# Altium schematic sheet 03 MCU.SchDoc: MCU
size 420 x 297 mm; SheetNumber: 3; SheetTotal: 6
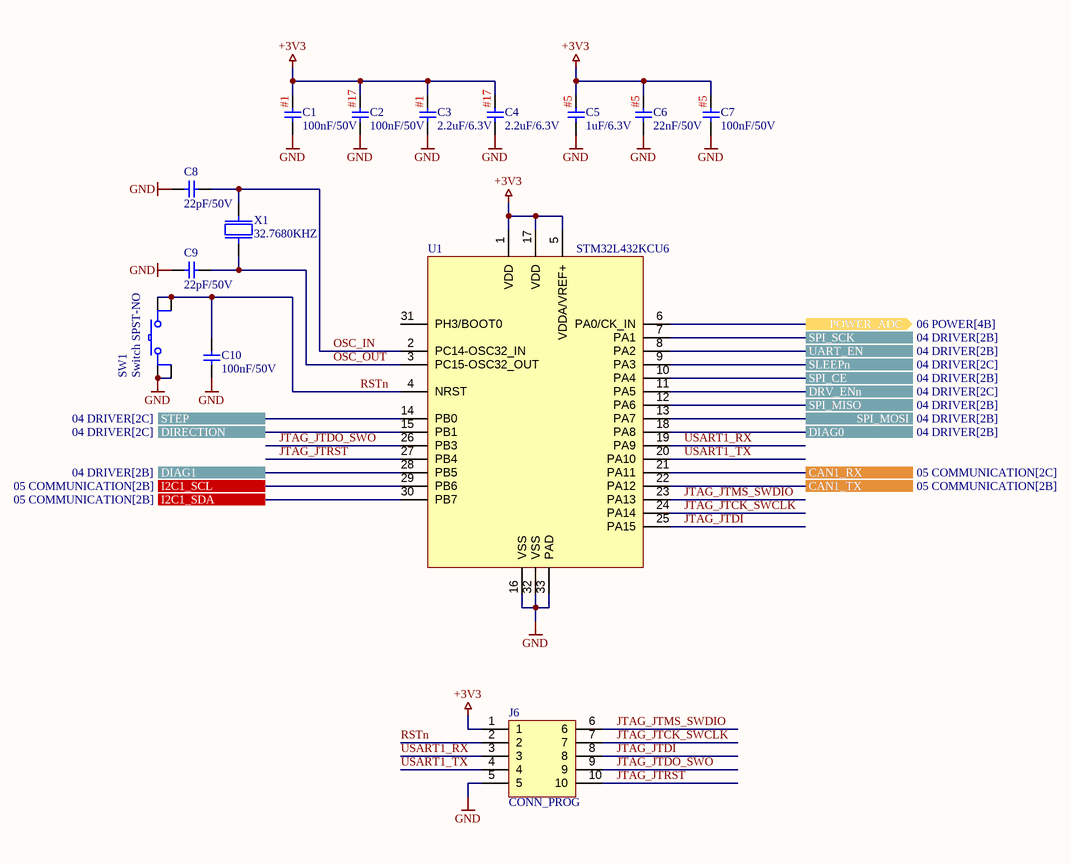
[diagram p0: 03 MCU.SchDoc]

## Parts
C1  100nF/50V  [CAPC1005X06M-0402]
C2  100nF/50V  [CAPC1005X06M-0402]
C3  2.2uF/6.3V  [CAPC1005X06M-0402]
C4  2.2uF/6.3V  [CAPC1005X06M-0402]
C5  1uF/6.3V  [CAPC1005X06M-0402]
C6  22nF/50V  [CAPC1005X06M-0402]
C7  100nF/50V  [CAPC1005X06M-0402]
C8  22pF/50V  [CAPC1005X06M-0402]
C9  22pF/50V  [CAPC1005X06M-0402]
C10  100nF/50V  [CAPC1005X06M-0402]
J6  CONN_PROG  [CONN_PROG]
SW1  Switch SPST-NO  [PTS815 SJM 250 SMTR LFS]
U1  STM32L432KCU6  [PQFN50P500X500X60_HS-33N]
X1  32.7680KHZ  [2-SMD]

## Ports
CAN1_RX (see 05 COMMUNICATION[2C]), CAN1_TX (see 05 COMMUNICATION[2B]), DIAG0 (see 04 DRIVER[2B]), DIAG1 (see 04 DRIVER[2B]), DIRECTION (see 04 DRIVER[2C]), DRV_ENn (see 04 DRIVER[2C]), I2C1_SCL (see 05 COMMUNICATION[2B]), I2C1_SDA (see 05 COMMUNICATION[2B]), POWER_ADC (out, see 06 POWER[4B]), SLEEPn (see 04 DRIVER[2C]), SPI_CE (see 04 DRIVER[2B]), SPI_MISO (see 04 DRIVER[2B]), SPI_MOSI (see 04 DRIVER[2B]), SPI_SCK (see 04 DRIVER[2B]), STEP (see 04 DRIVER[2C]), UART_EN (see 04 DRIVER[2B])

## Nets
+3V3: C1.2 C2.2 C3.2 C4.2 C5.2 C6.2 C7.2 J6.1 U1.1(VDD) U1.5(VDDA/VREF+) U1.17(VDD)
GND: C1.1 C2.1 C3.1 C4.1 C5.1 C6.1 C7.1 C8.1 C9.1 C10.1 J6.5 SW1.1 SW1.2 U1.16(VSS) U1.32(VSS) U1.33(PAD)
CAN1_RX: U1.21(PA11) ; port CAN1_RX
CAN1_TX: U1.22(PA12) ; port CAN1_TX
DIAG0: U1.18(PA8) ; port DIAG0
DIAG1: U1.28(PB5) ; port DIAG1
DIRECTION: U1.15(PB1) ; port DIRECTION
DRV_ENn: U1.11(PA5) ; port DRV_ENn
I2C1_SCL: U1.29(PB6) ; port I2C1_SCL
I2C1_SDA: U1.30(PB7) ; port I2C1_SDA
JTAG_JTCK_SWCLK: J6.7 U1.24(PA14)
JTAG_JTDI: J6.8 U1.25(PA15)
JTAG_JTDO_SWO: J6.9 U1.26(PB3)
JTAG_JTMS_SWDIO: J6.6 U1.23(PA13)
JTAG_JTRST: J6.10 U1.27(PB4)
OSC_IN: C8.2 U1.2(PC14-OSC32_IN) X1.2
OSC_OUT: C9.2 U1.3(PC15-OSC32_OUT) X1.1
POWER_ADC: U1.6(PA0/CK_IN) ; port POWER_ADC
RSTn: C10.2 J6.2 SW1.3 SW1.4 U1.4(NRST)
SLEEPn: U1.9(PA3) ; port SLEEPn
SPI_CE: U1.10(PA4) ; port SPI_CE
SPI_MISO: U1.12(PA6) ; port SPI_MISO
SPI_MOSI: U1.13(PA7) ; port SPI_MOSI
SPI_SCK: U1.7(PA1) ; port SPI_SCK
STEP: U1.14(PB0) ; port STEP
UART_EN: U1.8(PA2) ; port UART_EN
USART1_RX: J6.3 U1.19(PA9)
USART1_TX: J6.4 U1.20(PA10)

Not connected (* = marked no-connect by the designer): U1 31(PH3/BOOT0)

## Notes on the sheet
- (near C1) #1
- (near C2) #17
- (near C3) #1
- (near C4) #17
- (near C5) #5
- (near C6) #5
- (near C7) #5
- Title
- Project
- Size
- Date
- Revision
- A3
- Designed By

## Library data of the parts
C1 C2 C7 C10 = GRM155R71H104KE14D: 0.1 µF ±10% 50V Ceramic Capacitor X7R 0402 (1005 Metric); ComponentLink1Description: Datasheet; ComponentLink1URL: https://search.murata.co.jp/Ceramy/image/img/A01X/G101/ENG/GRM155R60J475ME47-01.pdf; MPN: GRM155R71H104KE14D
C3 C4 = GRM155C80J225KE95D: 2.2 µF ±10% 6.3V Ceramic Capacitor X6S 0402 (1005 Metric); ComponentLink1Description: Datasheet; ComponentLink1URL: https://search.murata.co.jp/Ceramy/image/img/A01X/G101/ENG/GRM155R60J475ME47-01.pdf; MPN: GRM155C80J225KE95D
C5 = GRM155R70J105KA12J: 1 µF ±10% 6.3V Ceramic Capacitor X7R 0402 (1005 Metric); ComponentLink1Description: Datasheet; ComponentLink1URL: https://search.murata.co.jp/Ceramy/image/img/A01X/G101/ENG/GRM155R60J475ME47-01.pdf; MPN: GRM155R70J105KA12J
C6 = GRM155R71H223KA12D: 0.022 µF ±10% 50V Ceramic Capacitor X7R 0402 (1005 Metric); ComponentLink1Description: Datasheet; ComponentLink1URL: https://search.murata.co.jp/Ceramy/image/img/A01X/G101/ENG/GRM155R60J475ME47-01.pdf; MPN: GRM155R71H223KA12D
C8 C9 = GRM1555C1H220JA01D: 22 pF ±5% 50V Ceramic Capacitor C0G, NP0 0402 (1005 Metric); ComponentLink1Description: Datasheet; ComponentLink1URL: https://search.murata.co.jp/Ceramy/image/img/A01X/G101/ENG/GRM155R60J475ME47-01.pdf; MPN: GRM1555C1H220JA01D
SW1 = PTS815 SJM 250 SMTR LFS: Tactile Switch SPST-NO Top Actuated Surface Mount; ComponentLink1Description: Datasheet; ComponentLink1URL: https://www.ckswitches.com/media/2728/pts815.pdf; MPN: PTS815 SJM 250 SMTR LFS
U1 = STM32L432KCU6: ARM® Cortex®-M4 STM32L4 Microcontroller IC 32-Bit Single-Core 80MHz 256KB (256K x 8) FLASH 32-UFQFPN (5x5); ComponentLink1Description: Datasheet; ComponentLink1URL: https://www.st.com/content/ccc/resource/technical/document/datasheet/24/01/9f/59/f0/83/47/fc/DM00257205.pdf/files/DM00257205.pdf/jcr:content/translations/en.DM00257205.pdf; MPN: STM32L432KCU6
X1 = ECS-.327-12.5-16-TR: 32.768 kHz ±20ppm Crystal 12.5pF 90 kOhms 2-SMD, No Lead; ComponentLink1Description: Datasheet; ComponentLink1URL: https://ecsxtal.com/store/pdf/ECX-16.pdf; MPN: ECS-.327-12.5-16-TR
J6 = CONN_PROG: ComponentLink1Description: Datasheet; MPN: CONN_PROG